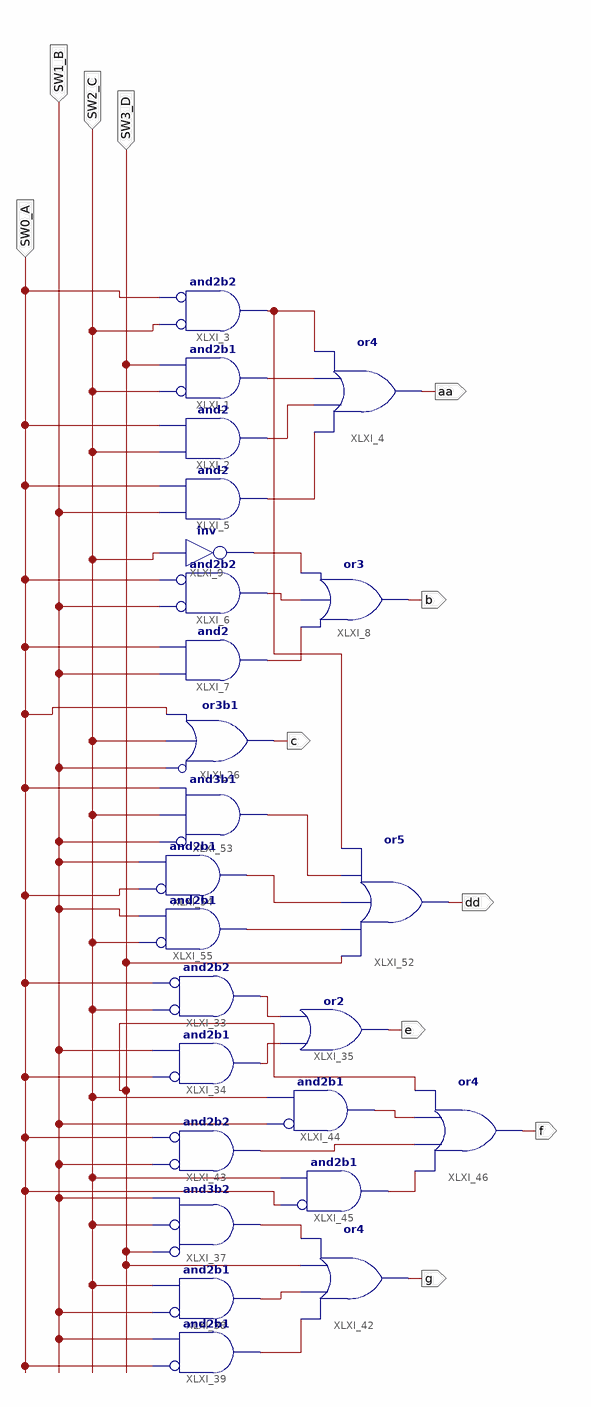
[diagram p0: schematic sheet 1]
// Xilinx ISE schematic segmentseven.sch (spartan6) as structural Verilog: 25 symbols, 11 ports
module segmentseven (
  input  SW0_A,
  input  SW3_D,
  input  SW1_B,
  input  SW2_C,
  output aa,
  output b,
  output c,
  output e,
  output g,
  output f,
  output dd
);

  wire XLXN_3, XLXN_4, XLXN_5, XLXN_8, XLXN_9, XLXN_10, XLXN_43, XLXN_44, XLXN_47, XLXN_48, XLXN_49, XLXN_53,
       XLXN_54, XLXN_55, XLXN_57, XLXN_58, XLXN_59, XLXN_60;

  and XLXI_1 (XLXN_3, ~SW2_C, SW3_D);  // and2b1
  and XLXI_2 (XLXN_4, SW2_C, SW0_A);
  and XLXI_3 (XLXN_57, ~SW2_C, ~SW0_A);  // and2b2
  or XLXI_4 (aa, XLXN_5, XLXN_4, XLXN_3, XLXN_57);
  and XLXI_5 (XLXN_5, SW1_B, SW0_A);
  and XLXI_6 (XLXN_9, ~SW1_B, ~SW0_A);  // and2b2
  and XLXI_7 (XLXN_10, SW1_B, SW0_A);
  or XLXI_8 (b, XLXN_10, XLXN_9, XLXN_8);
  not XLXI_9 (XLXN_8, SW2_C);
  or XLXI_26 (c, ~SW1_B, SW2_C, SW0_A);  // or3b1
  and XLXI_33 (XLXN_43, ~SW2_C, ~SW0_A);  // and2b2
  and XLXI_34 (XLXN_44, ~SW0_A, SW1_B);  // and2b1
  or XLXI_35 (e, XLXN_44, XLXN_43);
  and XLXI_37 (XLXN_47, ~SW3_D, ~SW2_C, SW1_B);  // and3b2
  and XLXI_38 (XLXN_48, ~SW1_B, SW2_C);  // and2b1
  and XLXI_39 (XLXN_49, ~SW0_A, SW1_B);  // and2b1
  or XLXI_42 (g, XLXN_49, XLXN_48, SW3_D, XLXN_47);
  and XLXI_43 (XLXN_54, ~SW1_B, ~SW0_A);  // and2b2
  and XLXI_44 (XLXN_53, ~SW1_B, SW2_C);  // and2b1
  and XLXI_45 (XLXN_55, ~SW0_A, SW2_C);  // and2b1
  or XLXI_46 (f, XLXN_55, XLXN_54, XLXN_53, SW3_D);
  or XLXI_52 (dd, SW3_D, XLXN_59, XLXN_58, XLXN_60, XLXN_57);
  and XLXI_53 (XLXN_60, ~SW1_B, SW2_C, SW0_A);  // and3b1
  and XLXI_54 (XLXN_58, ~SW0_A, SW1_B);  // and2b1
  and XLXI_55 (XLXN_59, ~SW2_C, SW1_B);  // and2b1
endmodule
